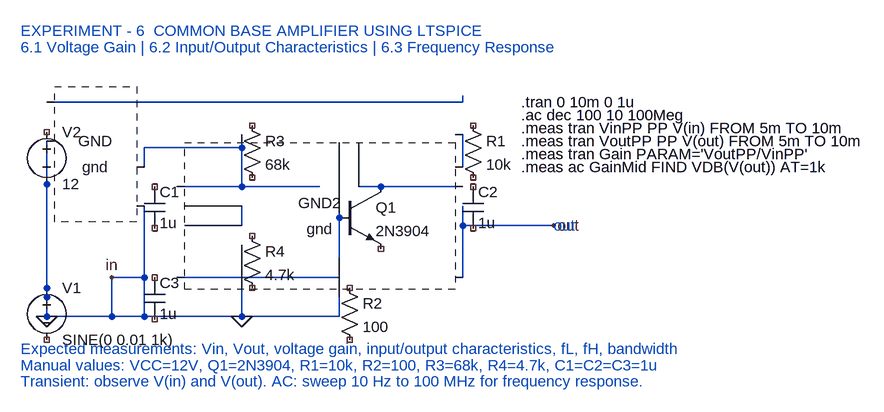
[diagram p0: schematic ECA0406_LTSpice_Common_Base_Amplifier.asc]
ECA0406_LTSpice_Common_Base_Amplifier.asc, the LTspice schematic file:
Version 4
SHEET 1 1200 800
FLAG 220 500 in
FLAG 900 420 out
FLAG 120 560 0
FLAG 420 560 0
SYMBOL voltage 120 260 R0
SYMATTR InstName V2
SYMATTR Value 12
SYMBOL voltage 120 500 R0
SYMATTR InstName V1
SYMATTR Value SINE(0 0.01 1k)
SYMATTR SpiceLine AC 1
SYMBOL npn 570 360 R0
SYMATTR InstName Q1
SYMATTR Value 2N3904
SYMBOL res 760 250 R0
SYMATTR InstName R1
SYMATTR Value 10k
SYMBOL res 570 500 R0
SYMATTR InstName R2
SYMATTR Value 100
SYMBOL res 420 250 R0
SYMATTR InstName R3
SYMATTR Value 68k
SYMBOL res 420 420 R0
SYMATTR InstName R4
SYMATTR Value 4.7k
SYMBOL cap 270 360 R0
SYMATTR InstName C1
SYMATTR Value 1u
SYMBOL cap 760 360 R0
SYMATTR InstName C2
SYMATTR Value 1u
SYMBOL cap 270 500 R0
SYMATTR InstName C3
SYMATTR Value 1u
SYMBOL gnd 120 560 R0
SYMATTR InstName GND
WIRE 120 230 760 230
WIRE 120 290 120 560
WIRE 120 530 120 560
WIRE 760 230 760 220
WIRE 760 280 760 330
WIRE 760 390 760 500
WIRE 570 400 570 470
WIRE 570 530 570 560
WIRE 570 560 120 560
WIRE 420 280 420 360
WIRE 420 390 420 420
WIRE 420 450 420 560
WIRE 420 360 540 360
WIRE 600 360 700 360
WIRE 700 360 760 360
WIRE 320 360 540 360
WIRE 220 500 220 560
WIRE 220 500 270 500
WIRE 320 500 570 500
WIRE 270 330 270 300
WIRE 270 300 420 300
WIRE 270 390 270 560
WIRE 760 390 760 420
WIRE 760 420 900 420
SYMBOL gnd 420 560 R0
SYMATTR InstName GND2
TEXT 80 120 Left 2 EXPERIMENT - 6  COMMON BASE AMPLIFIER USING LTSPICE
TEXT 80 145 Left 2 6.1 Voltage Gain | 6.2 Input/Output Characteristics | 6.3 Frequency Response
TEXT 80 610 Left 2 Expected measurements: Vin, Vout, voltage gain, input/output characteristics, fL, fH, bandwidth
TEXT 80 635 Left 2 Manual values: VCC=12V, Q1=2N3904, R1=10k, R2=100, R3=68k, R4=4.7k, C1=C2=C3=1u
TEXT 80 660 Left 2 Transient: observe V(in) and V(out). AC: sweep 10 Hz to 100 MHz for frequency response.
TEXT 900 420 Left 2 out
TEXT 850 230 Left 2 !.tran 0 10m 0 1u
TEXT 850 250 Left 2 !.ac dec 100 10 100Meg
TEXT 850 270 Left 2 !.meas tran VinPP PP V(in) FROM 5m TO 10m
TEXT 850 290 Left 2 !.meas tran VoutPP PP V(out) FROM 5m TO 10m
TEXT 850 310 Left 2 !.meas tran Gain PARAM='VoutPP/VinPP'
TEXT 850 330 Left 2 !.meas ac GainMid FIND VDB(V(out)) AT=1k

The netlist it stands for:
* ECA0406_LTSpice_Common_Base_Amplifier.asc
V2 NC_01 0 12
V1 0 NC_02 SINE(0 0.01 1k) AC 1
Q1 N006 N003 NC_03 0 2N3904
R1 NC_04 NC_05 10k
R2 NC_06 NC_07 100
R3 NC_08 NC_09 68k
R4 NC_10 NC_11 4.7k
C1 NC_12 NC_13 1u
C2 NC_14 NC_15 1u
C3 NC_16 NC_17 1u
* GND: gnd (symbol gnd not available, pin order unknown); nets seen at it: 0, N001, N004
* GND2: gnd (symbol gnd not available, pin order unknown); nets seen at it: 0, N002, N003, N004, N005, N006, N007, out
.model NPN NPN
.model PNP PNP
.lib standard.bjt
* EXPERIMENT - 6  COMMON BASE AMPLIFIER USING LTSPICE
* 6.1 Voltage Gain | 6.2 Input/Output Characteristics | 6.3 Frequency Response
* Expected measurements: Vin, Vout, voltage gain, input/output characteristics, fL, fH, bandwidth
* Manual values: VCC=12V, Q1=2N3904, R1=10k, R2=100, R3=68k, R4=4.7k, C1=C2=C3=1u
* Transient: observe V(in) and V(out). AC: sweep 10 Hz to 100 MHz for frequency response.
* out
.tran 0 10m 0 1u
.ac dec 100 10 100Meg
.meas tran VinPP PP V(in) FROM 5m TO 10m
.meas tran VoutPP PP V(out) FROM 5m TO 10m
.meas tran Gain PARAM='VoutPP/VinPP'
.meas ac GainMid FIND VDB(V(out)) AT=1k
.backanno
.end